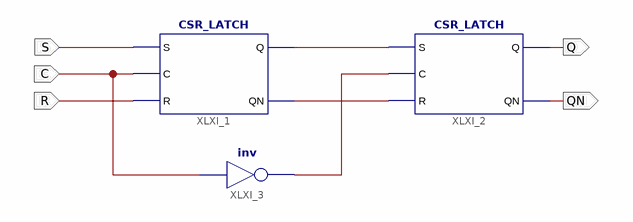
[diagram p0: schematic sheet 1]
// Xilinx ISE schematic MS_FLIPFLOP.sch (kintex7) as structural Verilog: 3 symbols, 5 ports
module MS_FLIPFLOP (
  input  S,
  input  C,
  input  R,
  output Q,
  output QN
);

  wire XLXN_1, XLXN_7, XLXN_8;

  CSR_LATCH XLXI_1 (.S(S), .C(C), .R(R), .Q(XLXN_7), .QN(XLXN_8));
  CSR_LATCH XLXI_2 (.S(XLXN_7), .C(XLXN_1), .R(XLXN_8), .Q(Q), .QN(QN));
  not XLXI_3 (XLXN_1, C);
endmodule
